# EAGLE schematic Water_Schematic2_1 (EAGLE 9.5.0)
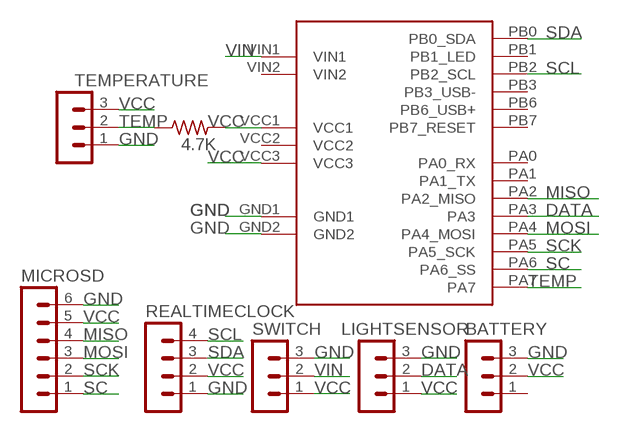
[diagram p0: schematic, sheet 1]

## Parts
BATTERY  MA03-1  [MA03-1]
LIGHTSENSOR  MA03-1  [MA03-1]
MICROSD  MA06-1  [MA06-1]
R1  4.7K  R-US_0204/7  [0204/7]
REALTIMECLOCK  MA04-1  [MA04-1]
SWITCH  MA03-1  [MA03-1]
TEMPERATURE  MA03-1  [MA03-1]
U$1  DIGISPARK_PRO  [DIGISPARK_PRO]

## Nets
DATA: LIGHTSENSOR.2 U$1.PA3
GND: BATTERY.3 LIGHTSENSOR.3 MICROSD.6 REALTIMECLOCK.1 SWITCH.3 TEMPERATURE.1 U$1.GND1 U$1.GND2
MISO: MICROSD.4 U$1.PA2(PA2_MISO)
MOSI: MICROSD.3 U$1.PA4(PA4_MOSI)
SC: MICROSD.1 U$1.PA6(PA6_SS)
SCK: MICROSD.2 U$1.PA5(PA5_SCK)
SCL: REALTIMECLOCK.4 U$1.PB2(PB2_SCL)
SDA: REALTIMECLOCK.3 U$1.PB0(PB0_SDA)
TEMP: R1.1 TEMPERATURE.2 U$1.PA7
VCC: BATTERY.2 LIGHTSENSOR.1 MICROSD.5 R1.2 REALTIMECLOCK.2 SWITCH.1 TEMPERATURE.3 U$1.VCC1 U$1.VCC3
VIN: SWITCH.2 U$1.VIN1
Unconnected: BATTERY.1 U$1.PA0(PA0_RX) U$1.PA1(PA1_TX) U$1.PB1(PB1_LED) U$1.PB3(PB3_USB-) U$1.PB6(PB6_USB+) U$1.PB7(PB7_RESET) U$1.VCC2 U$1.VIN2

## Library data of the parts
BATTERY LIGHTSENSOR SWITCH TEMPERATURE = con-lstb:MA03-1: PIN HEADER; OC_FARNELL: unknown; OC_NEWARK: unknown
MICROSD = con-lstb:MA06-1: PIN HEADER; OC_FARNELL: unknown; OC_NEWARK: unknown
R1 = rcl:R-US_: RESISTOR, American symbol; SPICEPREFIX: R
REALTIMECLOCK = con-lstb:MA04-1: PIN HEADER; OC_FARNELL: unknown; OC_NEWARK: unknown
U$1 = digistump:DIGISPARK_PRO